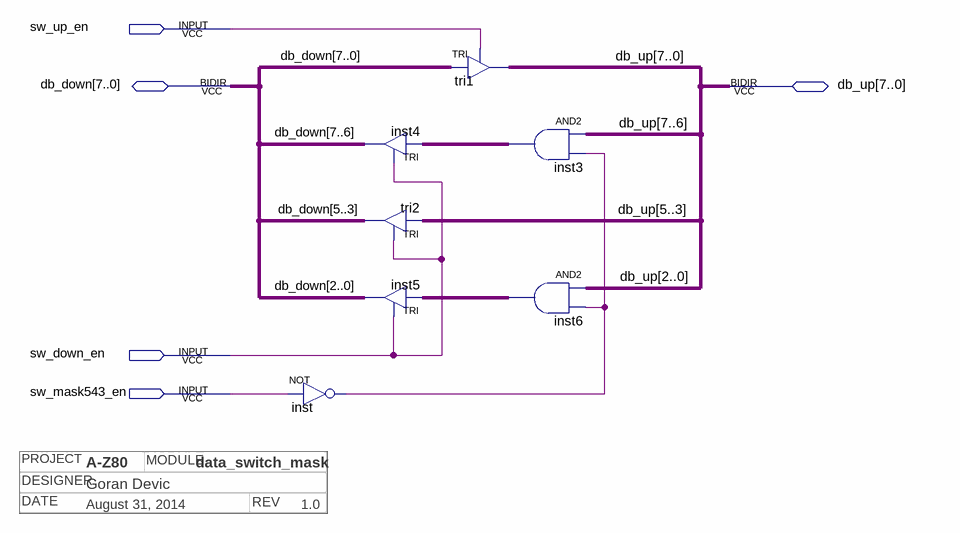
[diagram p0: schematic sheet]
// Quartus schematic data_switch_mask.bdf as structural Verilog: 7 symbols, 5 pins
// Title block: PROJECT: A-Z80; MODULE: data_switch_mask; DESIGNER: Goran Devic; DATE: August 31, 2014; REV: 1.0
module data_switch_mask (
  input  sw_up_en,
  input  sw_down_en,
  input  sw_mask543_en,
  inout  [7:0] db_down,
  inout  [7:0] db_up
);

  wire inst_out;
  wire [1:0] inst3_out;
  wire [2:0] inst6_out;

  not inst (inst_out, sw_mask543_en);
  TRI inst4[1:0] (.IN(inst3_out), .OE(sw_down_en), .OUT(db_down[7:6]));
  TRI tri2[2:0] (.IN(db_up[5:3]), .OE(sw_down_en), .OUT(db_down[5:3]));
  TRI inst5[2:0] (.IN(inst6_out), .OE(sw_down_en), .OUT(db_down[2:0]));
  TRI \tri1 [7:0] (.IN(db_down), .OE(sw_up_en), .OUT(db_up));
  assign inst3_out = db_up[7:6] & {2{inst_out}};  // AND2 inst3, 2 bits wide
  assign inst6_out = db_up[2:0] & {3{inst_out}};  // AND2 inst6, 3 bits wide
endmodule
